# Altium project MotoCtrl_Rev_1.0.0.PrjPcb
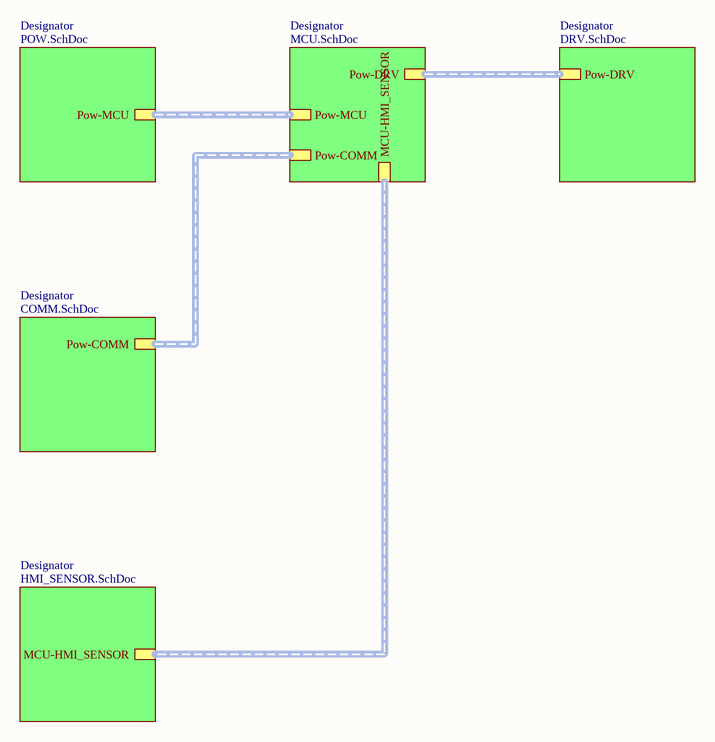
[diagram p0: TopLevel.SchDoc]
6 sheets, 157 parts. Net scope: hierarchical (ports join the sheet entries above them; power ports are global).
Board file: MotoCtrl_Rev_1.0.0.PcbDoc
Sheets:
  TopLevel.SchDoc
    Designator = POW.SchDoc
    Designator = MCU.SchDoc
    Designator = DRV.SchDoc
    Designator = COMM.SchDoc
    Designator = HMI_SENSOR.SchDoc

## Sheet TopLevel.SchDoc
size A4; SheetNumber: 1; SheetTotal: 6

### Sub-sheets
Designator = POW.SchDoc: Pow-MCU (harness Pow-MCU)
Designator = MCU.SchDoc: Pow-MCU (harness Pow-MCU), Pow-DRV (harness Pow-DRV), MCU-HMI_SENSOR (harness Pow-MCU), Pow-COMM (harness Pow-COMM)
Designator = DRV.SchDoc: Pow-DRV (harness Pow-DRV)
Designator = COMM.SchDoc: Pow-COMM (harness Pow-COMM)
Designator = HMI_SENSOR.SchDoc: MCU-HMI_SENSOR (harness Pow-HMI_SENSOR)

## Sheet POW.SchDoc
size A4; Revision: V1.0.0; SheetNumber: 2; SheetTotal: 6
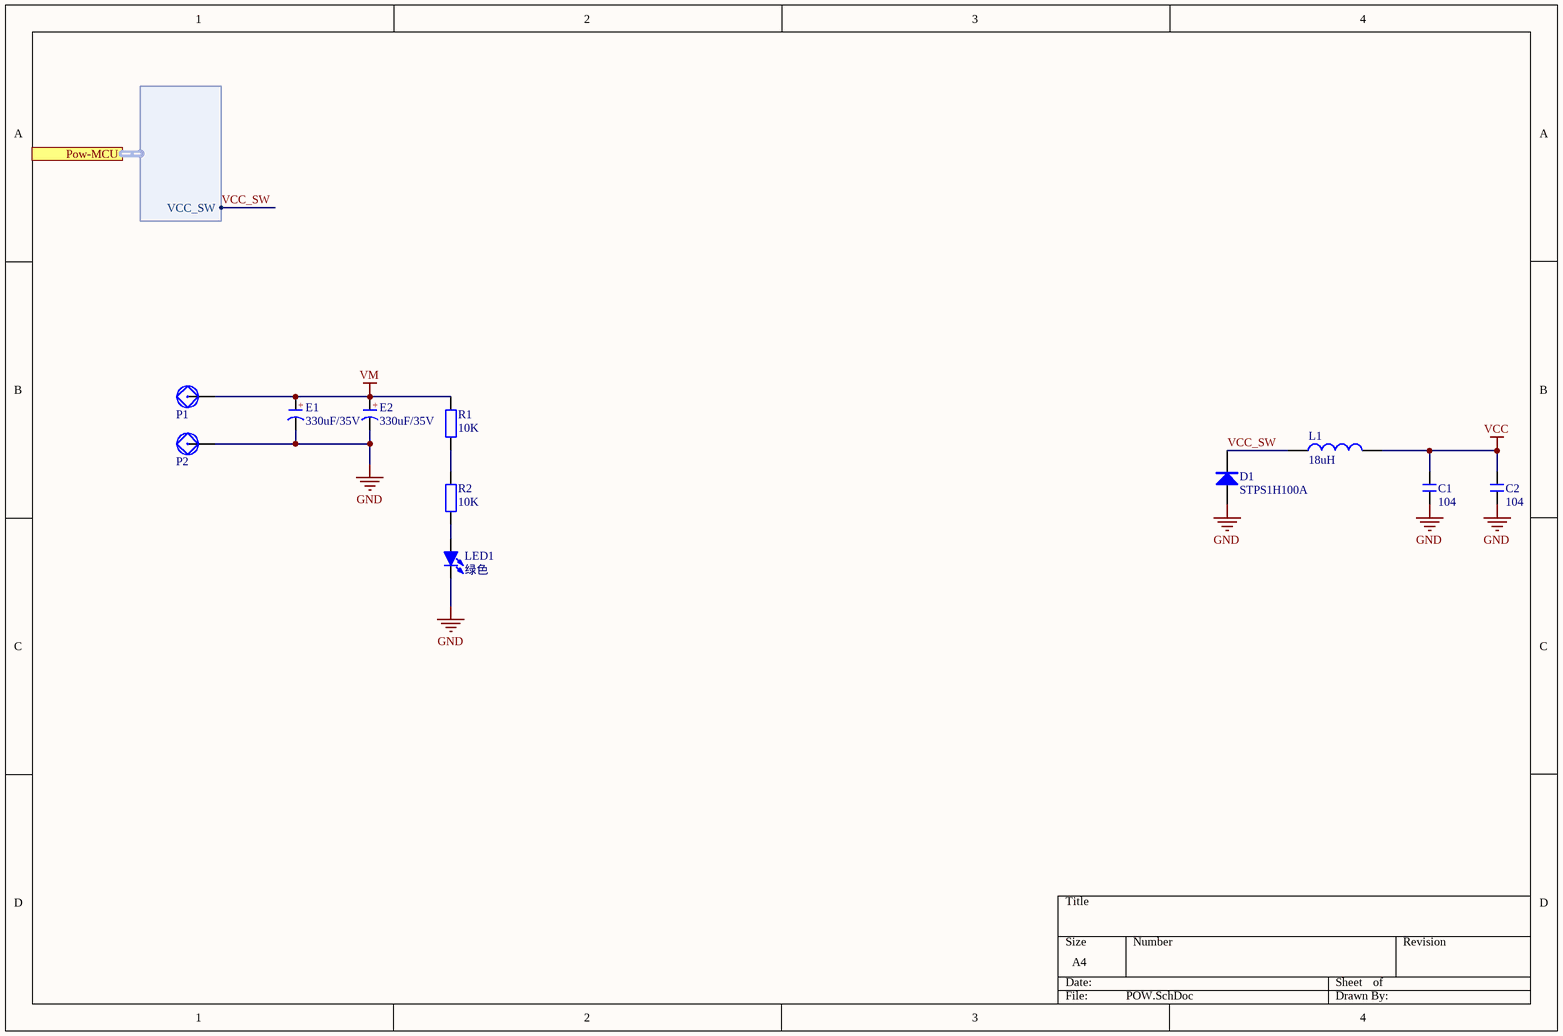
[diagram p1: POW.SchDoc]

### Parts
C1  104  [C 0805_L]
C2  104  [C 0805_L]
D1  STPS1H100A  [SMA]
E1  330uF/35V  [CAP 5.0*10*12.5]
E2  330uF/35V  [CAP 5.0*10*12.5]
L1  18uH  [L 0805]
LED1  绿色  [LED 0603G]
P1  功率焊盘  [功率焊盘]  (value not drawn)
P2  功率焊盘  [功率焊盘]  (value not drawn)
R1  10K  [R 0603_L]
R2  10K  [R 0603_L]

### Ports
Pow-MCU (harness Pow-MCU, see TopLevel[2B], MCU[1A])

### Harnesses
Pow-MCU: VCC_SW

### Nets
GND: C1.1 C2.1 D1.1(A) E1.2(K) E2.2(K) LED1.2(K) P2.1  [project net VSHUNT1N]
VCC: C1.2 C2.2 L1.2
VM: E1.1(A) E2.1(A) P1.1 R1.2
VCC_SW: D1.2(K) L1.1 ; port Pow-MCU.VCC_SW
NetLED1_1: LED1.1(A) R2.1
NetR1_1: R1.1 R2.2

### Notes on the sheet
- (in symbol C-CAP) +

### Library data of the parts
C1 C2 = C: 无极性贴片电容; 版权归属: 源创客; BOM名称: 无极性贴片电容; 学习资源: www.ooocke.com
D1 = SS14: 肖特基二极管; 版权归属: 源创客; 属性: 40V/1A; BOM名称: 肖特基二极管; 学习资源: www.ooocke.com
E1 E2 = C-CAP: 直插电解电容; 版权归属: 源创客; BOM名称: 直插电解电容; 学习资源: www.ooocke.com
L1 = L: 小功率贴片电感; 版权归属: 源创客; BOM名称: 小功率贴片电感; 学习资源: www.ooocke.com
LED1 = LED-SMD: 贴片LED; 版权归属: 源创客; BOM名称: 贴片LED; 学习资源: www.ooocke.com
R1 R2 = R: 贴片电阻; 版权归属: 源创客; BOM名称: 贴片电阻; 学习资源: www.ooocke.com

## Sheet MCU.SchDoc
size A4; SheetNumber: 3; SheetTotal: 6
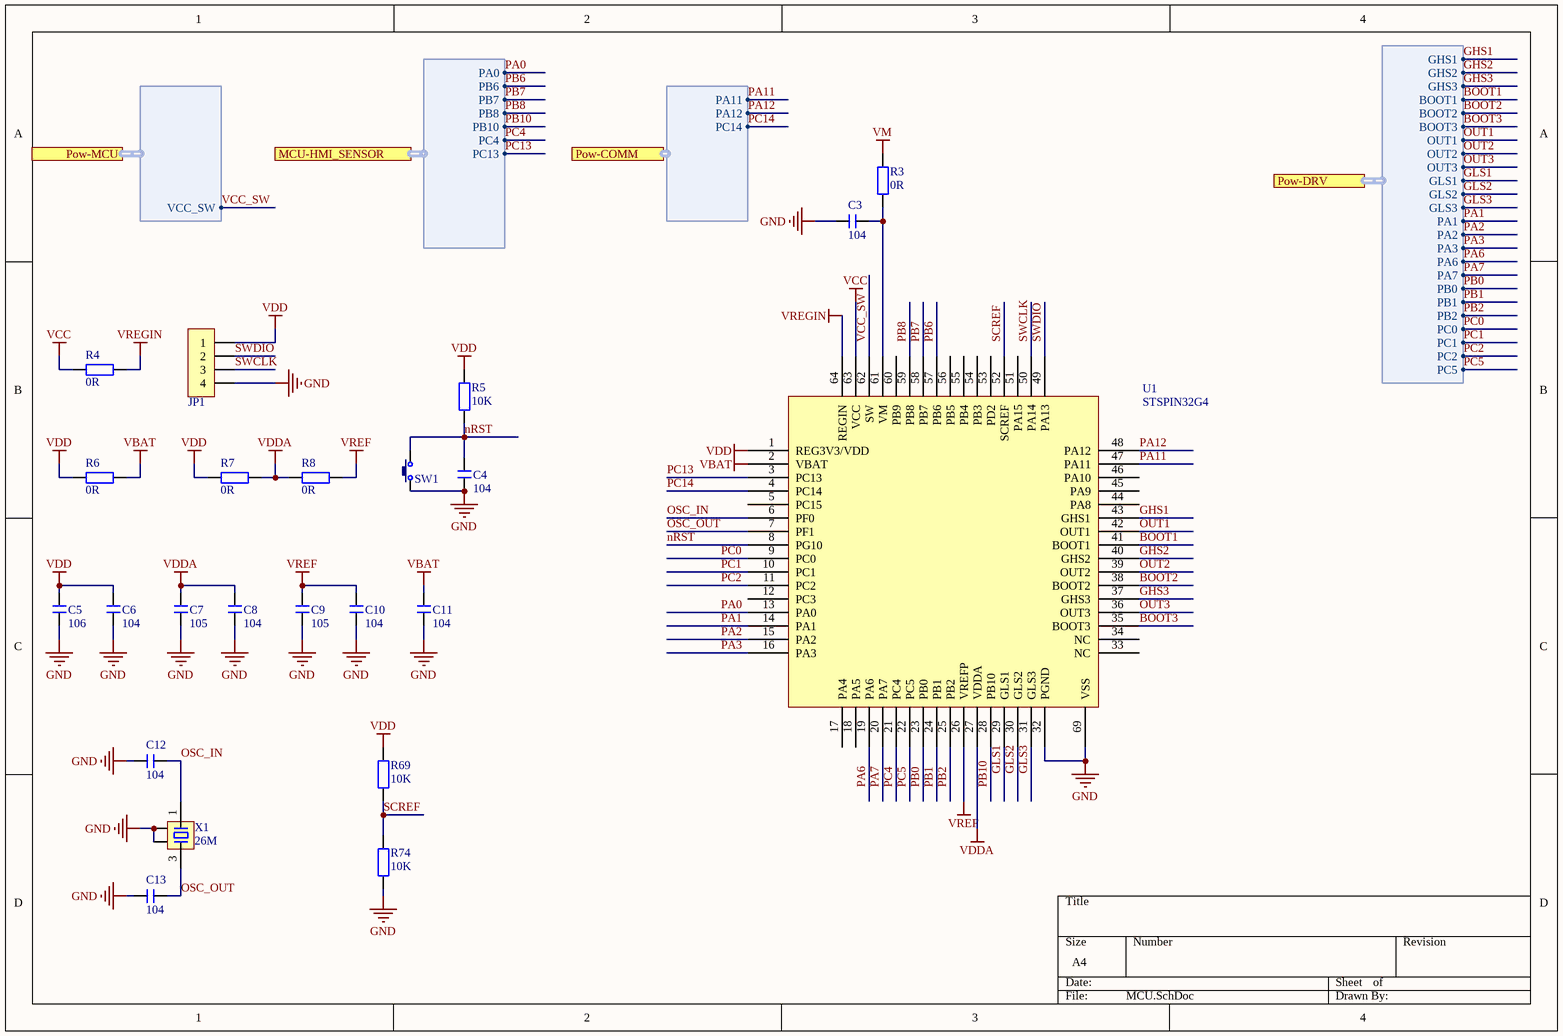
[diagram p2: MCU.SchDoc]

### Parts
C3  104  [C 0603_L]
C4  104  [C 0603_L]
C5  106  [C 0805_L]
C6  104  [C 0603_L]
C7  105  [C 0603_L]
C8  104  [C 0603_L]
C9  105  [C 0603_L]
C10  104  [C 0603_L]
C11  104  [C 0603_L]
C12  104  [C 0603_L]
C13  104  [C 0603_L]
JP1  HDR-1X4  [HDR2.54-LI-4P]  (value not drawn)
R3  0R  [R 0805_L]
R4  0R  [R 0603_L]
R5  10K  [R 0603_L]
R6  0R  [R 0603_L]
R7  0R  [R 0603_L]
R8  0R  [R 0603_L]
R69  10K  [R 0603_L]
R74  10K  [R 0603_L]
SW1  3x6x5  [TSW SMD-3*6*2.5]  (value not drawn)
U1  STSPIN32G4  [QFN64 9x9_L]
X1  26M  [OSC 3225-4P]

### Ports
MCU-HMI_SENSOR (harness Pow-HMI_SENSOR, see TopLevel[2B], HMI_SENSOR[1A]), Pow-COMM (harness Pow-COMM, see TopLevel[2B], COMM[1A]), Pow-DRV (harness Pow-DRV, see TopLevel[2A], DRV[1A]), Pow-MCU (harness Pow-MCU, see TopLevel[2B], POW[1A])

### Harnesses
Pow-MCU: VCC_SW
Pow-DRV: GHS1, GHS2, GHS3, BOOT1, BOOT2, BOOT3, OUT1, OUT2, OUT3, GLS1, GLS2, GLS3, PA1, PA2, PA3, PA6, PA7, PB0, PB1, PB2, PC5, PC0, PC1, PC2
Pow-HMI_SENSOR: PA0, PB6, PB7, PB8, PB10, PC4, PC13
Pow-COMM: PA11, PA12, PC14

### Nets
GND: C3.1 C4.1 C5.1 C6.1 C7.1 C8.1 C9.1 C10.1 C11.1 C12.2 C13.2 JP1.4 R74.1 SW1.1 U1.32(PGND) U1.69(VSS) X1.2 X1.4  [project net VSHUNT1N]
VBAT: C11.2 R6.1 U1.2(VBAT)
VCC: R4.2 U1.63(VCC)
VDD: C5.2 C6.2 JP1.1 R5.2 R6.2 R7.2 R69.2 U1.1(REG3V3/VDD)
VDDA: C7.2 C8.2 R7.1 R8.2 U1.27(VDDA)
VM: R3.2
VREF: C9.2 C10.2 R8.1 U1.26(VREFP)
VREGIN: R4.1 U1.64(REGIN)
BOOT1: U1.41(BOOT1) ; port Pow-DRV.BOOT1
BOOT2: U1.38(BOOT2) ; port Pow-DRV.BOOT2
BOOT3: U1.35(BOOT3) ; port Pow-DRV.BOOT3
GHS1: U1.43(GHS1) ; port Pow-DRV.GHS1
GHS2: U1.40(GHS2) ; port Pow-DRV.GHS2
GHS3: U1.37(GHS3) ; port Pow-DRV.GHS3
GLS1: U1.29(GLS1) ; port Pow-DRV.GLS1
GLS2: U1.30(GLS2) ; port Pow-DRV.GLS2
GLS3: U1.31(GLS3) ; port Pow-DRV.GLS3
nRST: C4.2 R5.1 SW1.2 U1.8(PG10)
OSC_IN: C12.1 U1.6(PF0) X1.1
OSC_OUT: C13.1 U1.7(PF1) X1.3
OUT1: U1.42(OUT1) ; port Pow-DRV.OUT1
OUT2: U1.39(OUT2) ; port Pow-DRV.OUT2
OUT3: U1.36(OUT3) ; port Pow-DRV.OUT3
PA0: U1.13(PA0) ; port MCU-HMI_SENSOR.PA0
PA1: U1.14(PA1) ; port Pow-DRV.PA1
PA2: U1.15(PA2) ; port Pow-DRV.PA2
PA3: U1.16(PA3) ; port Pow-DRV.PA3
PA6: U1.19(PA6) ; port Pow-DRV.PA6
PA7: U1.20(PA7) ; port Pow-DRV.PA7
PA11: U1.47(PA11) ; port Pow-COMM.PA11
PA12: U1.48(PA12) ; port Pow-COMM.PA12
PB0: U1.23(PB0) ; port Pow-DRV.PB0
PB1: U1.24(PB1) ; port Pow-DRV.PB1
PB2: U1.25(PB2) ; port Pow-DRV.PB2
PB6: U1.57(PB6) ; port MCU-HMI_SENSOR.PB6
PB7: U1.58(PB7) ; port MCU-HMI_SENSOR.PB7
PB8: U1.59(PB8) ; port MCU-HMI_SENSOR.PB8
PB10: U1.28(PB10) ; port MCU-HMI_SENSOR.PB10
PC0: U1.9(PC0) ; port Pow-DRV.PC0
PC1: U1.10(PC1) ; port Pow-DRV.PC1
PC2: U1.11(PC2) ; port Pow-DRV.PC2
PC4: U1.21(PC4) ; port MCU-HMI_SENSOR.PC4
PC5: U1.22(PC5) ; port Pow-DRV.PC5
PC13: U1.3(PC13) ; port MCU-HMI_SENSOR.PC13
PC14: U1.4(PC14) ; port Pow-COMM.PC14
SCREF: R69.1 R74.2 U1.52(SCREF)
SWCLK: JP1.3 U1.50(PA14)
SWDIO: JP1.2 U1.49(PA13)
VCC_SW: U1.62(SW) ; port Pow-MCU.VCC_SW
NetC3_2: C3.2 R3.1 U1.61(VM)

Not connected (* = marked no-connect by the designer): U1 5(PC15) 12(PC3) 17(PA4) 18(PA5) 33(NC) 34(NC) 44(PA8) 45(PA9) 46(PA10) 51(PA15) 53(PD2) 54(PB3) 55(PB4) 56(PB5) 60(PB9)

### Library data of the parts
C3-C13 = C: 无极性贴片电容; 版权归属: 源创客; BOM名称: 无极性贴片电容; 学习资源: www.ooocke.com
JP1 = Header 4: 4P接插件; 版权归属: 源创客; BOM名称: 4P接插件; 学习资源: www.ooocke.com
R3-R8 R69 R74 = R: 贴片电阻; 版权归属: 源创客; BOM名称: 贴片电阻; 学习资源: www.ooocke.com
SW1 = TSW 3x6: 3x6轻触开关; 版权归属: 源创客; BOM名称: 3x6轻触开关; 学习资源: www.ooocke.com
X1 = XTAL-4P: 4脚无源晶振; 版权归属: 源创客; BOM名称: 4脚无源晶振; 学习资源: www.ooocke.com

## Sheet DRV.SchDoc
size A4; SheetNumber: 5; SheetTotal: 6
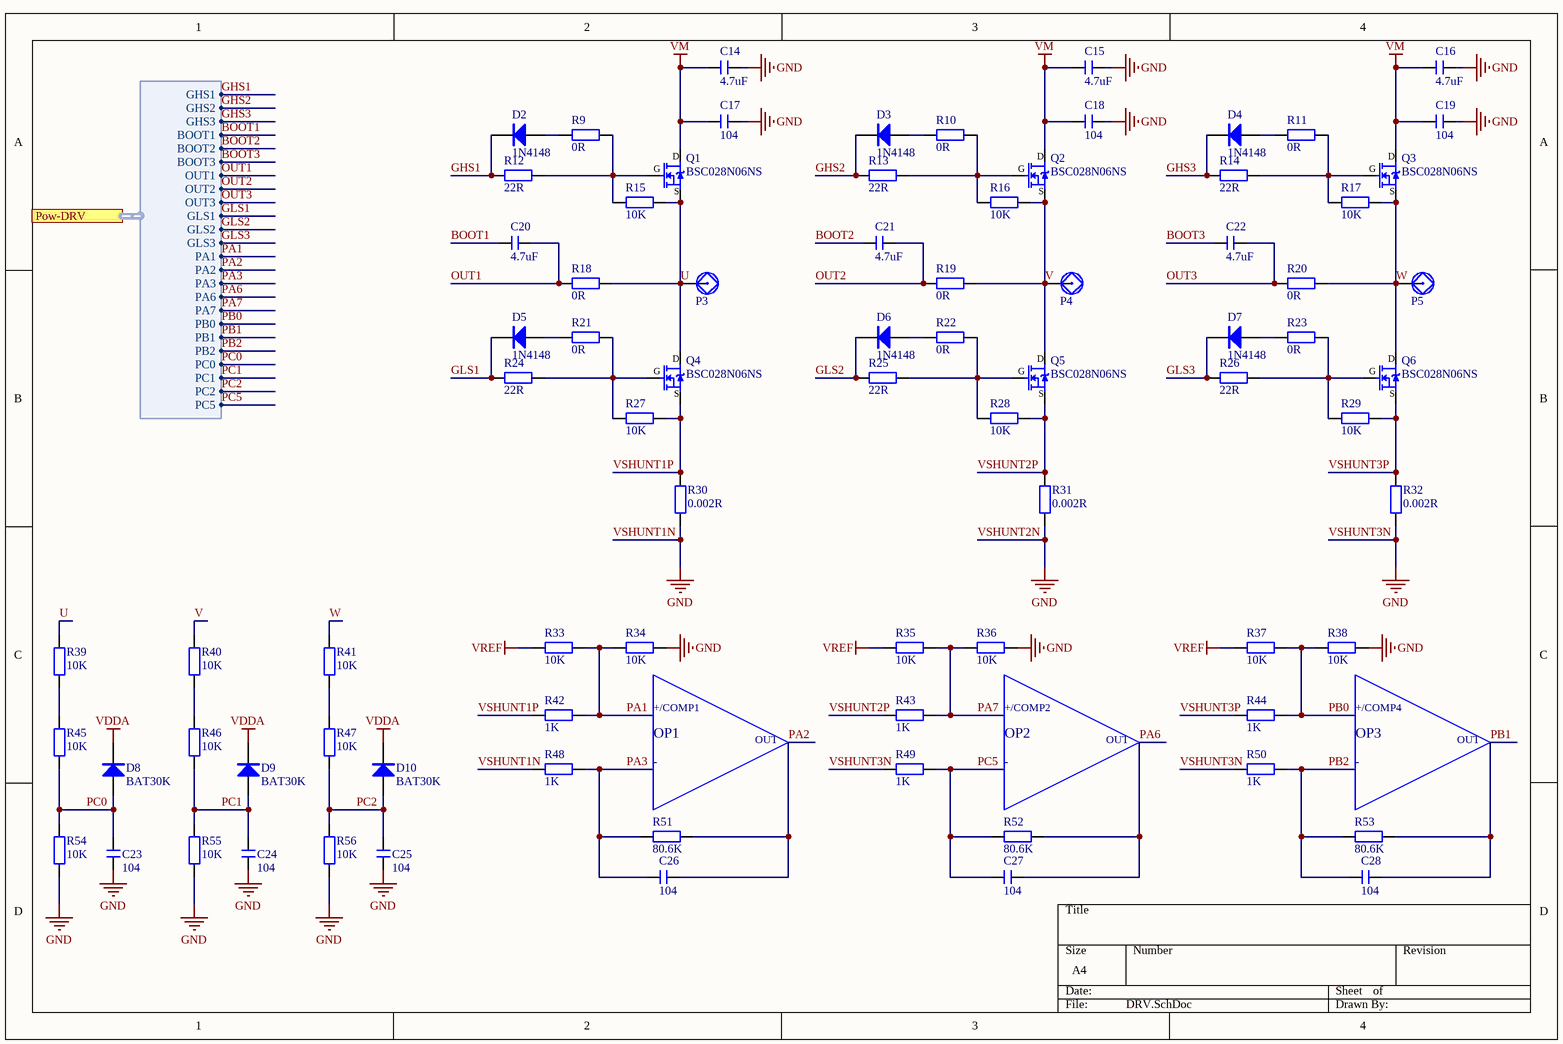
[diagram p3: DRV.SchDoc]

### Parts
C14  4.7uF  [C 1206_L]
C15  4.7uF  [C 1206_L]
C16  4.7uF  [C 1206_L]
C17  104  [C 0603_L]
C18  104  [C 0603_L]
C19  104  [C 0603_L]
C20  4.7uF  [C 0805_L]
C21  4.7uF  [C 0805_L]
C22  4.7uF  [C 0805_L]
C23  104  [C 0603_L]
C24  104  [C 0603_L]
C25  104  [C 0603_L]
C26  104  [C 0603_L]
C27  104  [C 0603_L]
C28  104  [C 0603_L]
D2  1N4148  [SOD-323]
D3  1N4148  [SOD-323]
D4  1N4148  [SOD-323]
D5  1N4148  [SOD-323]
D6  1N4148  [SOD-323]
D7  1N4148  [SOD-323]
D8  BAT30K  [SOD-523]
D9  BAT30K  [SOD-523]
D10  BAT30K  [SOD-523]
P3  功率焊盘  [功率焊盘]  (value not drawn)
P4  功率焊盘  [功率焊盘]  (value not drawn)
P5  功率焊盘  [功率焊盘]  (value not drawn)
Q1  BSC028N06NS  [BSC028N06NS]
Q2  BSC028N06NS  [BSC028N06NS]
Q3  BSC028N06NS  [BSC028N06NS]
Q4  BSC028N06NS  [BSC028N06NS]
Q5  BSC028N06NS  [BSC028N06NS]
Q6  BSC028N06NS  [BSC028N06NS]
R9  0R  [R 0603_L]
R10  0R  [R 0603_L]
R11  0R  [R 0603_L]
R12  22R  [R 0603_L]
R13  22R  [R 0603_L]
R14  22R  [R 0603_L]
R15  10K  [R 0603_L]
R16  10K  [R 0603_L]
R17  10K  [R 0603_L]
R18  0R  [R 0603_L]
R19  0R  [R 0603_L]
R20  0R  [R 0603_L]
R21  0R  [R 0603_L]
R22  0R  [R 0603_L]
R23  0R  [R 0603_L]
R24  22R  [R 0603_L]
R25  22R  [R 0603_L]
R26  22R  [R 0603_L]
R27  10K  [R 0603_L]
R28  10K  [R 0603_L]
R29  10K  [R 0603_L]
R30  0.002R  [R 2512_M]
R31  0.002R  [R 2512_M]
R32  0.002R  [R 2512_M]
R33  10K  [R 0603_L]
R34  10K  [R 0603_L]
R35  10K  [R 0603_L]
R36  10K  [R 0603_L]
R37  10K  [R 0603_L]
R38  10K  [R 0603_L]
R39  10K  [R 0603_L]
R40  10K  [R 0603_L]
R41  10K  [R 0603_L]
R42  1K  [R 0603_L]
R43  1K  [R 0603_L]
R44  1K  [R 0603_L]
R45  10K  [R 0603_L]
R46  10K  [R 0603_L]
R47  10K  [R 0603_L]
R48  1K  [R 0603_L]
R49  1K  [R 0603_L]
R50  1K  [R 0603_L]
R51  80.6K  [R 0603_L]
R52  80.6K  [R 0603_L]
R53  80.6K  [R 0603_L]
R54  10K  [R 0603_L]
R55  10K  [R 0603_L]
R56  10K  [R 0603_L]

### Ports
Pow-DRV (harness Pow-DRV, see TopLevel[3A], MCU[4A])

### Harnesses
Pow-DRV: GHS1, GHS2, GHS3, BOOT1, BOOT2, BOOT3, OUT1, OUT2, OUT3, GLS1, GLS2, GLS3, PA1, PA2, PA3, PA6, PA7, PB0, PB1, PB2, PC5, PC0, PC1, PC2

### Nets
VDDA: D8.2(K) D9.2(K) D10.2(K)
VM: C14.2 C15.2 C16.2 C17.2 C18.2 C19.2 Q1.3(D) Q2.3(D) Q3.3(D)
VREF: R33.2 R35.2 R37.2
VSHUNT1N: C14.1 C15.1 C16.1 C17.1 C18.1 C19.1 C23.2 C24.2 C25.2 R30.2 R31.2 R32.2 R34.1 R36.1 R38.1 R48.2 R49.2 R50.2 R54.2 R55.2 R56.2  [also labelled GND, VSHUNT2N, VSHUNT3N]
BOOT1: C20.2 ; port Pow-DRV.BOOT1
BOOT2: C21.2 ; port Pow-DRV.BOOT2
BOOT3: C22.2 ; port Pow-DRV.BOOT3
GHS1: D2.2(K) R12.2 ; port Pow-DRV.GHS1
GHS2: D3.2(K) R13.2 ; port Pow-DRV.GHS2
GHS3: D4.2(K) R14.2 ; port Pow-DRV.GHS3
GLS1: D5.2(K) R24.2 ; port Pow-DRV.GLS1
GLS2: D6.2(K) R25.2 ; port Pow-DRV.GLS2
GLS3: D7.2(K) R26.2 ; port Pow-DRV.GLS3
OUT1: C20.1 R18.2 ; port Pow-DRV.OUT1
OUT2: C21.1 R19.2 ; port Pow-DRV.OUT2
OUT3: C22.1 R20.2 ; port Pow-DRV.OUT3
PA1: R33.1 R34.2 R42.1 ; port Pow-DRV.PA1
PA2: C26.1 R51.1 ; port Pow-DRV.PA2
PA3: C26.2 R48.1 R51.2 ; port Pow-DRV.PA3
PA6: C27.1 R52.1 ; port Pow-DRV.PA6
PA7: R35.1 R36.2 R43.1 ; port Pow-DRV.PA7
PB0: R37.1 R38.2 R44.1 ; port Pow-DRV.PB0
PB1: C28.1 R53.1 ; port Pow-DRV.PB1
PB2: C28.2 R50.1 R53.2 ; port Pow-DRV.PB2
PC0: C23.1 D8.1(A) R45.2 R54.1 ; port Pow-DRV.PC0
PC1: C24.1 D9.1(A) R46.2 R55.1 ; port Pow-DRV.PC1
PC2: C25.1 D10.1(A) R47.2 R56.1 ; port Pow-DRV.PC2
PC5: C27.2 R49.1 R52.2 ; port Pow-DRV.PC5
U: P3.1 Q1.1(S) Q4.3(D) R15.1 R18.1 R39.1
V: P4.1 Q2.1(S) Q5.3(D) R16.1 R19.1 R40.1
VSHUNT1P: Q4.1(S) R27.1 R30.1 R42.2
VSHUNT2P: Q5.1(S) R28.1 R31.1 R43.2
VSHUNT3P: Q6.1(S) R29.1 R32.1 R44.2
W: P5.1 Q3.1(S) Q6.3(D) R17.1 R20.1 R41.1
NetD2_1: D2.1(A) R9.2
NetD3_1: D3.1(A) R10.2
NetD4_1: D4.1(A) R11.2
NetD5_1: D5.1(A) R21.2
NetD6_1: D6.1(A) R22.2
NetD7_1: D7.1(A) R23.2
NetQ1_2: Q1.2(G) R9.1 R12.1 R15.2
NetQ2_2: Q2.2(G) R10.1 R13.1 R16.2
NetQ3_2: Q3.2(G) R11.1 R14.1 R17.2
NetQ4_2: Q4.2(G) R21.1 R24.1 R27.2
NetQ5_2: Q5.2(G) R22.1 R25.1 R28.2
NetQ6_2: Q6.2(G) R23.1 R26.1 R29.2
NetR39_2: R39.2 R45.1
NetR40_2: R40.2 R46.1
NetR41_2: R41.2 R47.1

### Notes on the sheet
- +/COMP1
- +/COMP2
- +/COMP4
- OP1
- -
- OUT
- OP2
- OP3

### Library data of the parts
C14-C28 = C: 无极性贴片电容; 版权归属: 源创客; BOM名称: 无极性贴片电容; 学习资源: www.ooocke.com
D2-D7 = 1N4148: 高速开关二极管; 版权归属: 源创客; BOM名称: 高速开关二极管; 学习资源: www.ooocke.com
D8-D10 = SS14: 肖特基二极管; 版权归属: 源创客; 属性: 40V/1A; BOM名称: 肖特基二极管; 学习资源: www.ooocke.com
Q1-Q6 = BSC028N06NS: N沟场，60V/100A; BOM名称: N沟场效应管; 版权归属: 源创客; 学习资源: www.ooocke.com
R9-R56 = R: 贴片电阻; 版权归属: 源创客; BOM名称: 贴片电阻; 学习资源: www.ooocke.com

## Sheet COMM.SchDoc
size A4; SheetNumber: 4; SheetTotal: 6
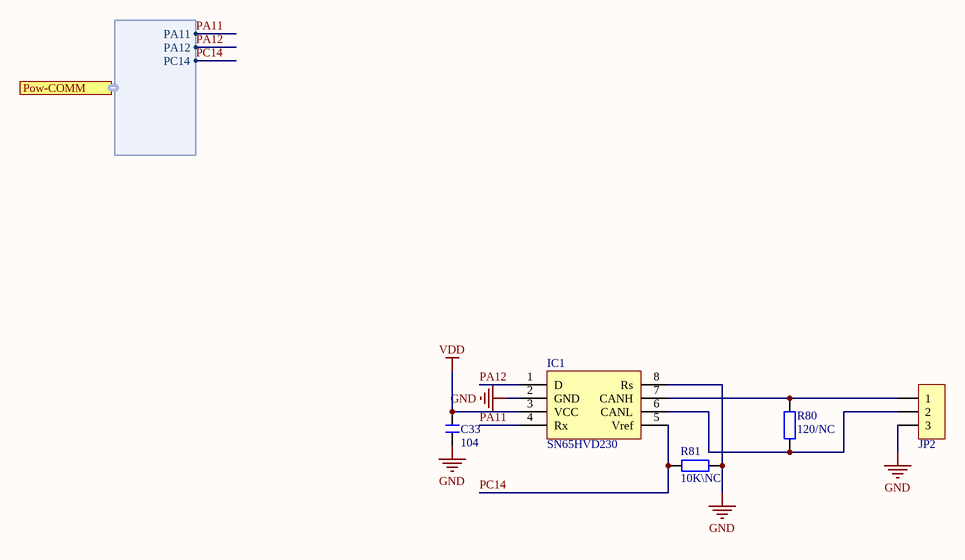
[diagram p4: COMM.SchDoc]

### Parts
C33  104  [C 0603_L]
IC1  SN65HVD230  [SOP8_N]
JP2  HDR-1X3  [XH2.54-WI-3P]  (value not drawn)
R80  120/NC  [R 1206_L]
R81  10K\NC  [R 0603_L]

### Ports
Pow-COMM (harness Pow-COMM, see TopLevel[2C], MCU[2A])

### Harnesses
Pow-COMM: PA11, PA12, PC14

### Nets
GND: C33.2 IC1.2(GND) IC1.8(Rs) JP2.3 R81.2  [project net VSHUNT1N]
VDD: C33.1 IC1.3(VCC)
PA11: IC1.4(Rx) ; port Pow-COMM.PA11
PA12: IC1.1(D) ; port Pow-COMM.PA12
PC14: IC1.5(Vref) R81.1 ; port Pow-COMM.PC14
NetIC1_6: IC1.6(CANL) JP2.2 R80.1
NetIC1_7: IC1.7(CANH) JP2.1 R80.2

### Library data of the parts
C33 = C: 无极性贴片电容; 版权归属: 源创客; BOM名称: 无极性贴片电容; 学习资源: www.ooocke.com
IC1 = SN65HVD230: CAN芯片; 版权归属: 源创客; BOM名称: CAN芯片; 学习资源: www.ooocke.com
JP2 = Header 3: 3P接插件; 版权归属: 源创客; BOM名称: 3P接插件; 学习资源: www.ooocke.com
R80 R81 = R: 贴片电阻; 版权归属: 源创客; BOM名称: 贴片电阻; 学习资源: www.ooocke.com

## Sheet HMI_SENSOR.SchDoc
size A4; SheetNumber: 6; SheetTotal: 6
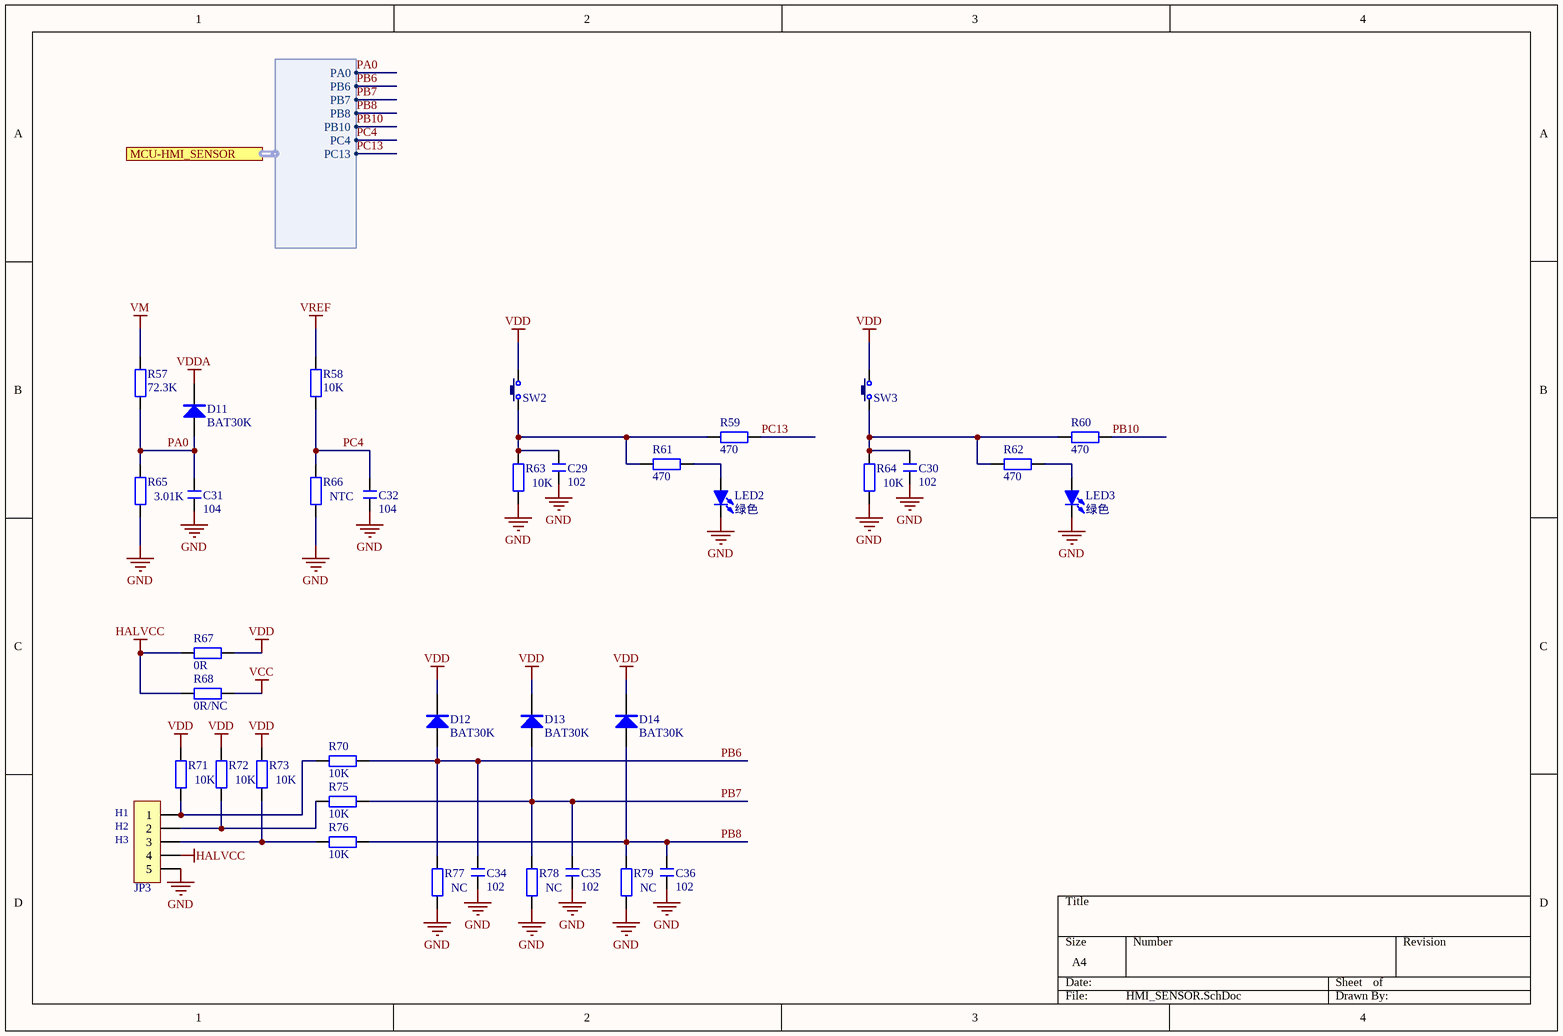
[diagram p5: HMI_SENSOR.SchDoc]

### Parts
C29  102  [C 0603_L]
C30  102  [C 0603_L]
C31  104  [C 0603_L]
C32  104  [C 0603_L]
C34  102  [C 0603_L]
C35  102  [C 0603_L]
C36  102  [C 0603_L]
D11  BAT30K  [SOD-523]
D12  BAT30K  [SOD-523]
D13  BAT30K  [SOD-523]
D14  BAT30K  [SOD-523]
JP3  HDR-1X5  [XH2.54-WI-5P]  (value not drawn)
LED2  绿色  [LED 0603G]
LED3  绿色  [LED 0603G]
R57  72.3K  [R 0603_L]
R58  10K  [R 0603_L]
R59  470  [R 0603_L]
R60  470  [R 0603_L]
R61  470  [R 0603_L]
R62  470  [R 0603_L]
R63  10K  [R 0603_L]
R64  10K  [R 0603_L]
R65  3.01K  [R 0603_L]
R66  NTC  [R 0603_M]
R67  0R  [R 0603_L]
R68  0R/NC  [R 0603_L]
R70  10K  [R 0603_L]
R71  10K  [R 0603_L]
R72  10K  [R 0603_L]
R73  10K  [R 0603_L]
R75  10K  [R 0603_L]
R76  10K  [R 0603_L]
R77  NC  [R 0603_L]
R78  NC  [R 0603_L]
R79  NC  [R 0603_L]
SW2  3x6x5  [TSW SMD-3*6*2.5]  (value not drawn)
SW3  3x6x5  [TSW SMD-3*6*2.5]  (value not drawn)

### Ports
MCU-HMI_SENSOR (harness Pow-HMI_SENSOR, see TopLevel[2D], MCU[1A])

### Harnesses
Pow-HMI_SENSOR: PA0, PB6, PB7, PB8, PB10, PC4, PC13

### Nets
GND: C29.2 C30.2 C31.2 C32.2 C34.2 C35.2 C36.2 JP3.5 LED2.2(K) LED3.2(K) R63.2 R64.2 R65.2 R66.2 R77.2 R78.2 R79.2  [project net VSHUNT1N]
HALVCC: JP3.4 R67.2 R68.2
VCC: R68.1
VDD: D12.2(K) D13.2(K) D14.2(K) R67.1 R71.1 R72.1 R73.1 SW2.2 SW3.2
VDDA: D11.2(K)
VM: R57.1
VREF: R58.1
PA0: C31.1 D11.1(A) R57.2 R65.1 ; port MCU-HMI_SENSOR.PA0
PB6: C34.1 D12.1(A) R70.2 R77.1 ; port MCU-HMI_SENSOR.PB6
PB7: C35.1 D13.1(A) R75.2 R78.1 ; port MCU-HMI_SENSOR.PB7
PB8: C36.1 D14.1(A) R76.2 R79.1 ; port MCU-HMI_SENSOR.PB8
PB10: R60.2 ; port MCU-HMI_SENSOR.PB10
PC4: C32.1 R58.2 R66.1 ; port MCU-HMI_SENSOR.PC4
PC13: R59.2 ; port MCU-HMI_SENSOR.PC13
NetC29_1: C29.1 R59.1 R61.1 R63.1 SW2.1
NetC30_1: C30.1 R60.1 R62.1 R64.1 SW3.1
NetJP3_1: JP3.1 R70.1 R71.2
NetJP3_2: JP3.2 R72.2 R75.1
NetJP3_3: JP3.3 R73.2 R76.1
NetLED2_1: LED2.1(A) R61.2
NetLED3_1: LED3.1(A) R62.2

### Notes on the sheet
- (near JP3) H1
- (near JP3) H2
- (near JP3) H3

### Library data of the parts
C29-C32 C34-C36 = C: 无极性贴片电容; 版权归属: 源创客; BOM名称: 无极性贴片电容; 学习资源: www.ooocke.com
D11-D14 = SS14: 肖特基二极管; 版权归属: 源创客; 属性: 40V/1A; BOM名称: 肖特基二极管; 学习资源: www.ooocke.com
JP3 = Header 5: 5P接插件; 版权归属: 源创客; BOM名称: 5P接插件; 学习资源: www.ooocke.com
LED2 LED3 = LED-SMD: 贴片LED; 版权归属: 源创客; BOM名称: 贴片LED; 学习资源: www.ooocke.com
R57-R68 R70-R73 R75-R79 = R: 贴片电阻; 版权归属: 源创客; BOM名称: 贴片电阻; 学习资源: www.ooocke.com
SW2 SW3 = TSW 3x6: 3x6轻触开关; 版权归属: 源创客; BOM名称: 3x6轻触开关; 学习资源: www.ooocke.com

## Nets that join several sheets
VCC: POW (C1.2 C2.2 L1.2), MCU (R4.2 U1.63), HMI_SENSOR (R68.1)
VDD: MCU (8 pins), COMM (C33.1 IC1.3), HMI_SENSOR (9 pins)
VDDA: MCU (5 pins), DRV (D8.2 D9.2 D10.2), HMI_SENSOR (D11.2)
VM: POW (E1.1 E2.1 P1.1 R1.2), MCU (R3.2), DRV (9 pins), HMI_SENSOR (R57.1)
VREF: MCU (C9.2 C10.2 R8.1 U1.26), DRV (R33.2 R35.2 R37.2), HMI_SENSOR (R58.1)
VSHUNT1N: POW (7 pins), MCU (18 pins), DRV (21 pins), COMM (5 pins), HMI_SENSOR (17 pins)
BOOT1: MCU (U1.41), DRV (C20.2)
BOOT2: MCU (U1.38), DRV (C21.2)
BOOT3: MCU (U1.35), DRV (C22.2)
GHS1: MCU (U1.43), DRV (D2.2 R12.2)
GHS2: MCU (U1.40), DRV (D3.2 R13.2)
GHS3: MCU (U1.37), DRV (D4.2 R14.2)
GLS1: MCU (U1.29), DRV (D5.2 R24.2)
GLS2: MCU (U1.30), DRV (D6.2 R25.2)
GLS3: MCU (U1.31), DRV (D7.2 R26.2)
OUT1: MCU (U1.42), DRV (C20.1 R18.2)
OUT2: MCU (U1.39), DRV (C21.1 R19.2)
OUT3: MCU (U1.36), DRV (C22.1 R20.2)
PA0: MCU (U1.13), HMI_SENSOR (C31.1 D11.1 R57.2 R65.1)
PA1: MCU (U1.14), DRV (R33.1 R34.2 R42.1)
PA2: MCU (U1.15), DRV (C26.1 R51.1)
PA3: MCU (U1.16), DRV (C26.2 R48.1 R51.2)
PA6: MCU (U1.19), DRV (C27.1 R52.1)
PA7: MCU (U1.20), DRV (R35.1 R36.2 R43.1)
PA11: MCU (U1.47), COMM (IC1.4)
PA12: MCU (U1.48), COMM (IC1.1)
PB0: MCU (U1.23), DRV (R37.1 R38.2 R44.1)
PB1: MCU (U1.24), DRV (C28.1 R53.1)
PB2: MCU (U1.25), DRV (C28.2 R50.1 R53.2)
PB6: MCU (U1.57), HMI_SENSOR (C34.1 D12.1 R70.2 R77.1)
PB7: MCU (U1.58), HMI_SENSOR (C35.1 D13.1 R75.2 R78.1)
PB8: MCU (U1.59), HMI_SENSOR (C36.1 D14.1 R76.2 R79.1)
PB10: MCU (U1.28), HMI_SENSOR (R60.2)
PC0: MCU (U1.9), DRV (C23.1 D8.1 R45.2 R54.1)
PC1: MCU (U1.10), DRV (C24.1 D9.1 R46.2 R55.1)
PC2: MCU (U1.11), DRV (C25.1 D10.1 R47.2 R56.1)
PC4: MCU (U1.21), HMI_SENSOR (C32.1 R58.2 R66.1)
PC5: MCU (U1.22), DRV (C27.2 R49.1 R52.2)
PC13: MCU (U1.3), HMI_SENSOR (R59.2)
PC14: MCU (U1.4), COMM (IC1.5 R81.1)
VCC_SW: POW (D1.2 L1.1), MCU (U1.62)